# EAGLE design Chassis board (EAGLE 9.6.2)
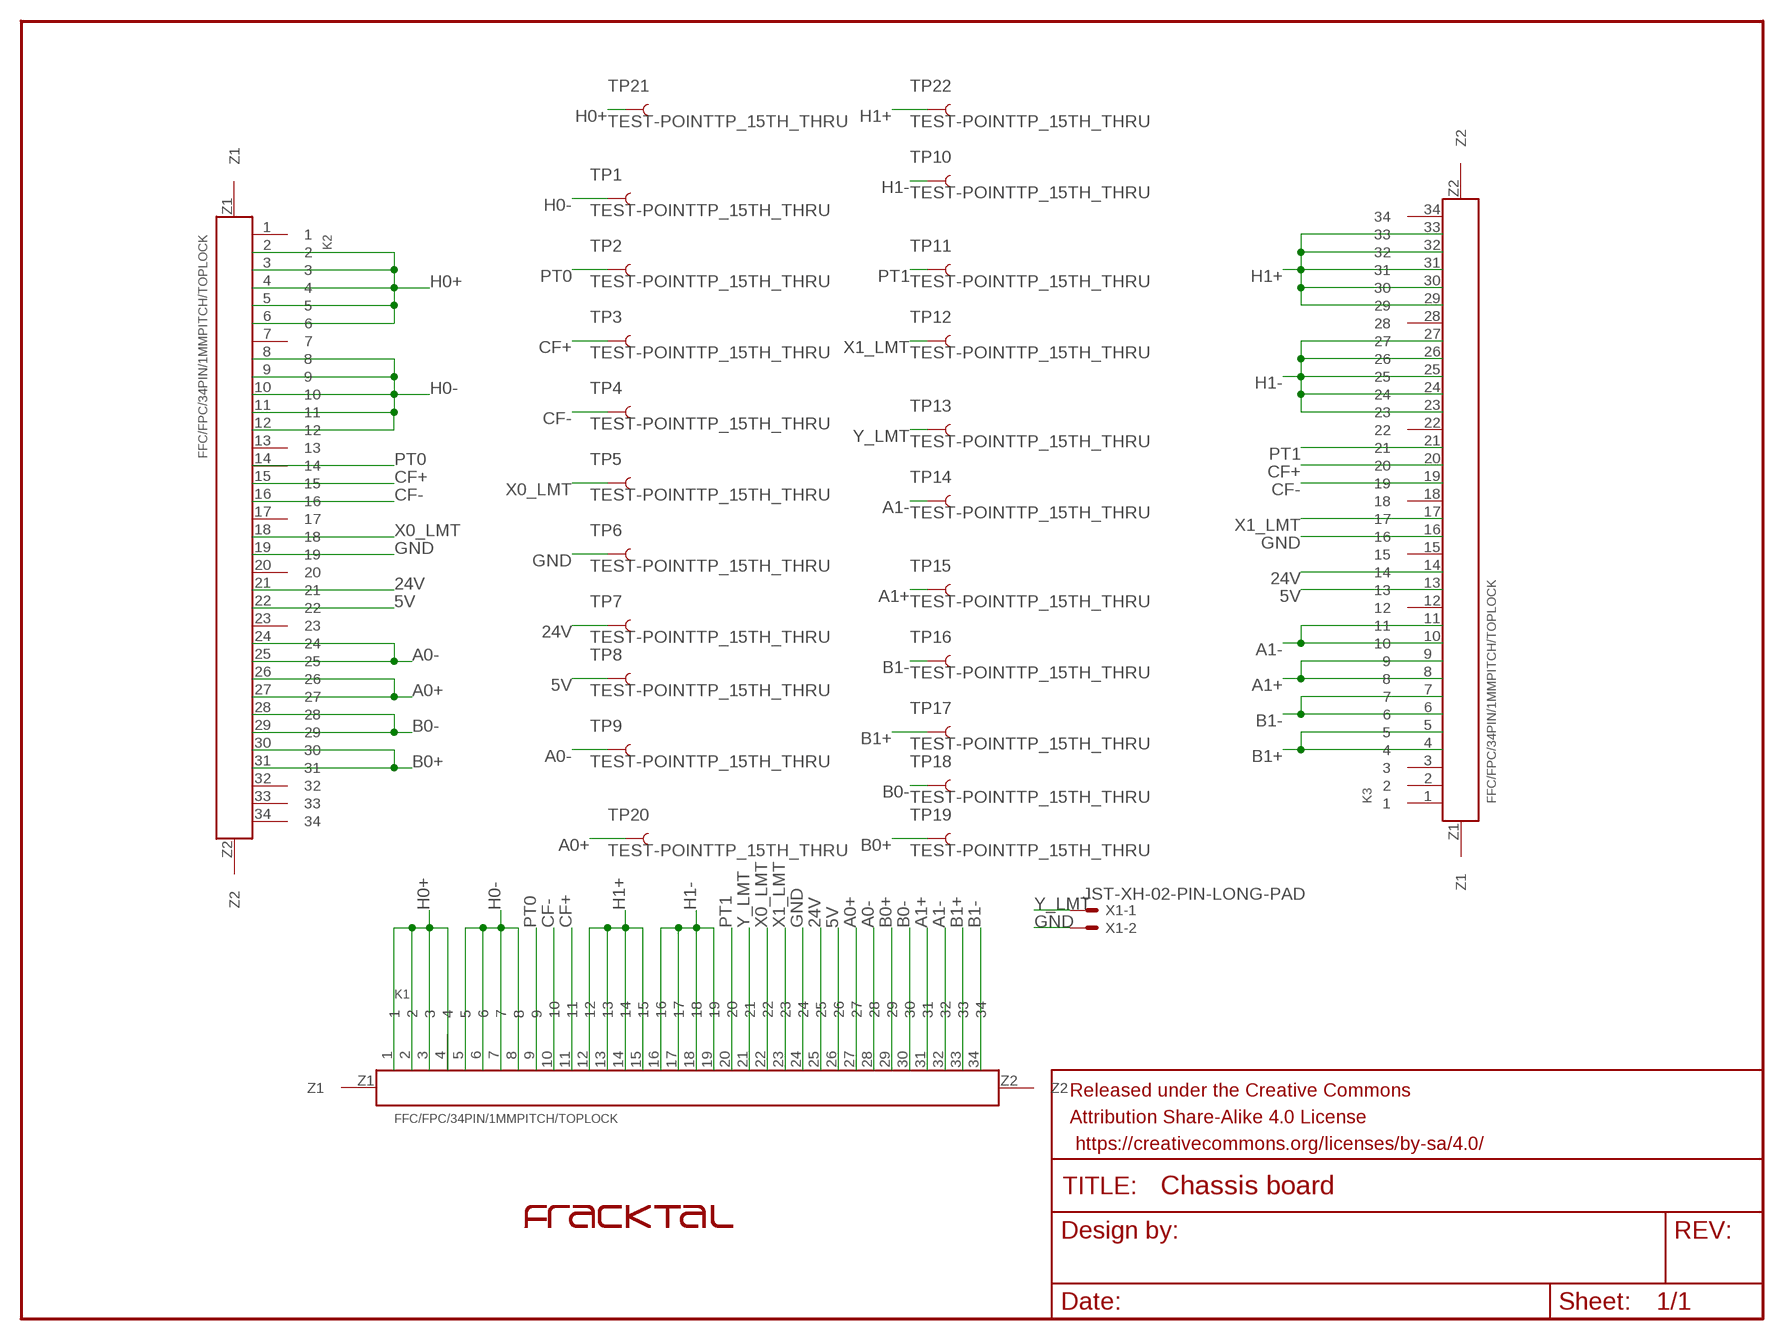
[diagram p0: schematic, sheet 1]

## Parts
FRAME1  FRAME-LETTER  [CREATIVE_COMMONS]
K1  FFC/FPC/34PIN/1MMPITCH/TOPLOCK  [34PIN/1MMPITCH/FFC/FPC]
K2  FFC/FPC/34PIN/1MMPITCH/TOPLOCK  [34PIN/1MMPITCH/FFC/FPC]
K3  FFC/FPC/34PIN/1MMPITCH/TOPLOCK  [34PIN/1MMPITCH/FFC/FPC]
TP1  TEST-POINTTP_15TH_THRU  [TP_15TH]
TP2  TEST-POINTTP_15TH_THRU  [TP_15TH]
TP3  TEST-POINTTP_15TH_THRU  [TP_15TH]
TP4  TEST-POINTTP_15TH_THRU  [TP_15TH]
TP5  TEST-POINTTP_15TH_THRU  [TP_15TH]
TP6  TEST-POINTTP_15TH_THRU  [TP_15TH]
TP7  TEST-POINTTP_15TH_THRU  [TP_15TH]
TP8  TEST-POINTTP_15TH_THRU  [TP_15TH]
TP9  TEST-POINTTP_15TH_THRU  [TP_15TH]
TP10  TEST-POINTTP_15TH_THRU  [TP_15TH]
TP11  TEST-POINTTP_15TH_THRU  [TP_15TH]
TP12  TEST-POINTTP_15TH_THRU  [TP_15TH]
TP13  TEST-POINTTP_15TH_THRU  [TP_15TH]
TP14  TEST-POINTTP_15TH_THRU  [TP_15TH]
TP15  TEST-POINTTP_15TH_THRU  [TP_15TH]
TP16  TEST-POINTTP_15TH_THRU  [TP_15TH]
TP17  TEST-POINTTP_15TH_THRU  [TP_15TH]
TP18  TEST-POINTTP_15TH_THRU  [TP_15TH]
TP19  TEST-POINTTP_15TH_THRU  [TP_15TH]
TP20  TEST-POINTTP_15TH_THRU  [TP_15TH]
TP21  TEST-POINTTP_15TH_THRU  [TP_15TH]
TP22  TEST-POINTTP_15TH_THRU  [TP_15TH]
U$2  FRACKTALLOGO  [FRACKTALLOGO]
X1  JST-XH-02-PIN-LONG-PAD  [JST-XH-02-PACKAGE-LONG-PAD]

## Nets
5V: K1.26 K2.22 K3.13 TP8.P$1
24V: K1.25 K2.21 K3.14 TP7.P$1
A0+: K1.27 K2.26 K2.27 TP20.P$1
A0-: K1.28 K2.24 K2.25 TP9.P$1
A1+: K1.31 K3.8 K3.9 TP15.P$1
A1-: K1.32 K3.10 K3.11 TP14.P$1
B0+: K1.29 K2.30 K2.31 TP19.P$1
B0-: K1.30 K2.28 K2.29 TP18.P$1
B1+: K1.33 K3.4 K3.5 TP17.P$1
B1-: K1.34 K3.6 K3.7 TP16.P$1
CF+: K1.11 K2.15 K3.20 TP3.P$1
CF-: K1.10 K2.16 K3.19 TP4.P$1
GND: K1.24 K2.19 K3.16 TP6.P$1 X1.2
H0+: K1.1 K1.2 K1.3 K1.4 K2.2 K2.3 K2.4 K2.5 K2.6 TP21.P$1
H0-: K1.5 K1.6 K1.7 K1.8 K2.8 K2.9 K2.10 K2.11 K2.12 TP1.P$1
H1+: K1.12 K1.13 K1.14 K1.15 K3.29 K3.30 K3.31 K3.32 K3.33 TP22.P$1
H1-: K1.16 K1.17 K1.18 K1.19 K3.23 K3.24 K3.25 K3.26 K3.27 TP10.P$1
PT0: K1.9 K2.14 TP2.P$1
PT1: K1.20 K3.21 TP11.P$1
X0_LMT: K1.22 K2.18 TP5.P$1
X1_LMT: K1.23 K3.17 TP12.P$1
Y_LMT: K1.21 TP13.P$1 X1.1
Unconnected: K1.Z1 K1.Z2 K2.1 K2.7 K2.13 K2.17 K2.20 K2.23 K2.32 K2.33 K2.34 K2.Z1 K2.Z2 K3.1 K3.2 K3.3 K3.12 K3.15 K3.18 K3.22 K3.28 K3.34 K3.Z1 K3.Z2

## Library data of the parts
FRAME1 = SparkFun-Aesthetics:FRAME-LETTER: Schematic Frame - Letter Standard 8.5x11 US Letter frame
K1-K3 = FracktalWorks_Eagle_Library:FFC/FPC/34PIN/1MMPITCH/TOPLOCK
TP1-TP22 = SparkFun-Connectors:TEST-POINT: SparkFun Test Points Bare copper test points for troubleshooting or In-Circuit-Testing. These are used by our Production team for verifying production board runs using pogo-pins on test beds. SparkFun Products: SparkFun LSM9DS1 Breakout <https://www.sparkfun.com/products/13284> SparkFun PSOC <https://www.sparkfun.com/products/13714> SparkFun Load Cell Amplifier <https://www.sparkfun.com/products/13879>
U$2 = FracktalWorks_Eagle_Library:FRACKTALLOGO
X1 = Rembrandt Electronics - JST XH Connectors v1-0:JST-XH-02-PIN: JST XH Connector 2 Pin Wire to board connector. Pitch: 2,54 mm, (0.100") Number of pins: 2 Created by Rembrandt Electronics www.rembrandtelectronics.com

## Board
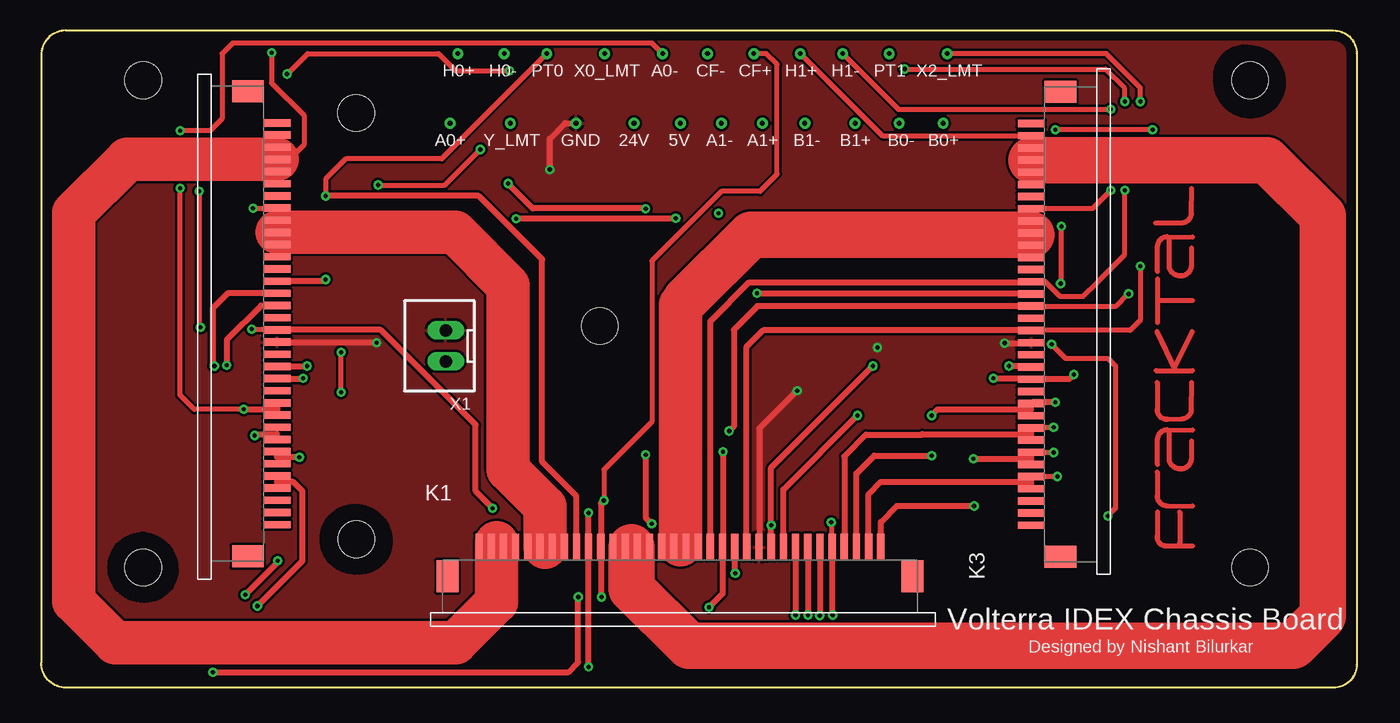
[diagram p1: board, top side]
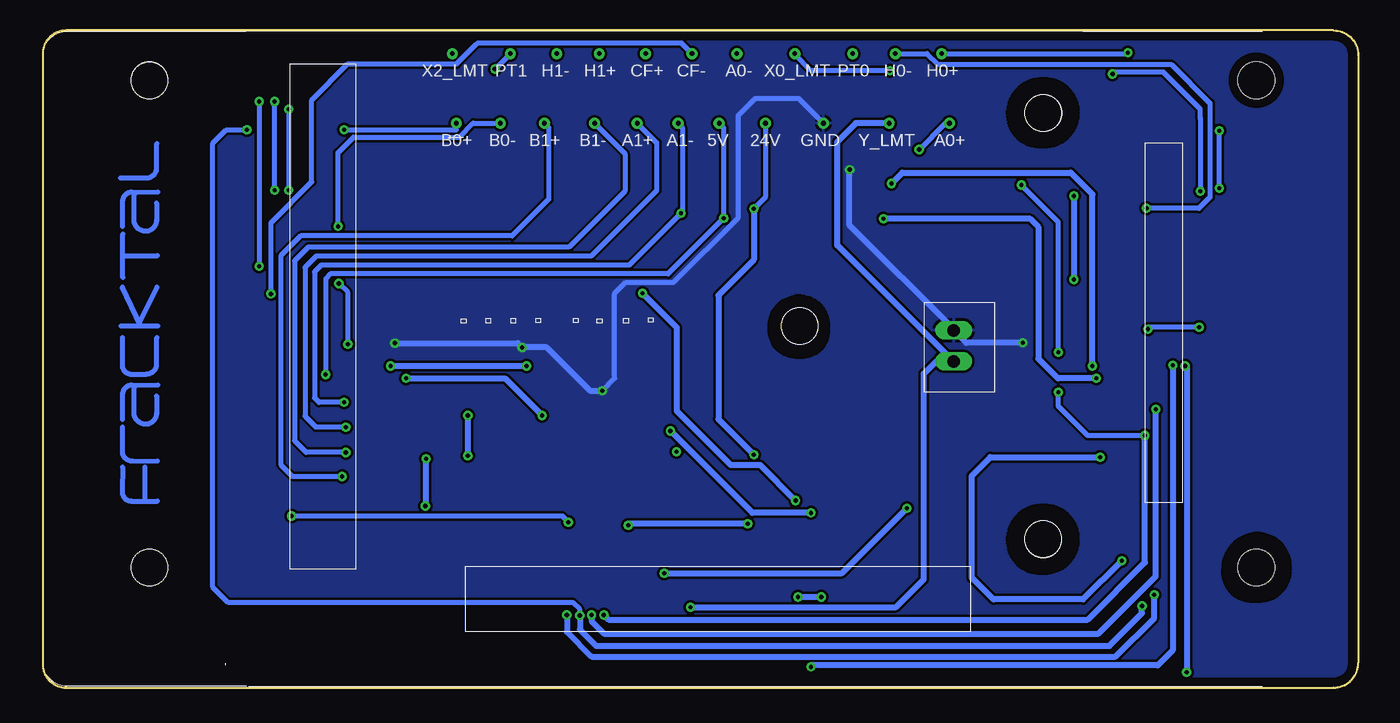
[diagram p2: board, bottom side, seen from below]

Size 108.08 x 53.97 mm. Coordinates in mm from the lower left corner, seen from the top.
Outline: 2.03,53.97 106.17,53.97 arc-90 108.08,52.07 108.08,1.9 arc-90 106.17,0 2.03,0 arc-90 0,2.03 0,51.94 arc-90 2.03,53.97
Copper layers (1*16): Top 0.035mm / dielectric 1.5mm / Bottom 0.035mm
Design rules "LionCircuits": minimum track width 8mil, minimum drill 0.35mm, track to track 8mil, track to pad 8mil, pad to pad 8mil, via to via 8mil, smd to smd 8mil, copper to edge 30mil, drill to drill 10mil, minimum pad ring 10mil, minimum via ring 8mil, stop-mask expansion 4mil, vias tented up to drill 0mil, thermal gap 10mil
Holes 3 mm at 8.38,49.88 99.32,49.88 99.32,9.88 8.38,9.88 25.88,47.18 25.89,12.2 45.88,29.7

### Footprints (pad centres in the part's own frame; a part is rotated, then mirrored left to right if it is on the bottom)
34PIN/1MMPITCH/FFC/FPC = smd 0.6 x 2.2: 1 -14.43,2.1; 2 -13.43,2.1; 3 -12.43,2.1; 4 -11.43,2.1; 5 -10.43,2.1; 6 -9.43,2.1; 7 -8.43,2.1; 8 -7.43,2.1; 9 -6.43,2.1; 10 -5.43,2.1; 11 -4.43,2.1; 12 -3.43,2.1; 13 -2.43,2.1; 14 -1.43,2.1; 15 -0.43,2.1; 16 0.57,2.1; 17 1.57,2.1; 18 2.57,2.1; 19 3.57,2.1; 20 4.57,2.1; 21 5.57,2.1; 22 6.57,2.1; 23 7.57,2.1; 24 8.57,2.1; 25 9.57,2.1; 26 10.57,2.1; 27 11.57,2.1; 28 12.57,2.1; 29 13.57,2.1; 30 14.57,2.1; 31 15.57,2.1; 32 16.57,2.1; 33 17.57,2.1; 34 18.57,2.1 | smd 1.8 x 2.6: Z1 -17.03,-0.3; Z2 21.17,-0.3
TP_15TH = drill 0.381 pad 0.61: P$1 0,0
JST-XH-02-PACKAGE-LONG-PAD = drill 1.016 long: 1 -1.27,0; 2 1.27,0

### Placement (x,y rotation side)
FRAME1  -81.79,43.18 0 top  (outside the outline)
K1  50.4,9.45 0 top
K2  17.27,31.95 270 top
K3  83.43,27.76 90 top
TP1  38.04,52.07 0 bottom
TP2  41.53,52.07 0 bottom
TP3  58.55,52.07 0 bottom
TP4  54.74,52.07 0 bottom
TP5  46.29,52.07 0 bottom
TP6  43.94,46.35 0 bottom
TP7  48.7,46.35 0 bottom
TP8  52.51,46.35 0 bottom
TP9  51.05,52.07 0 bottom
TP10  65.85,52.07 0 bottom
TP11  69.66,52.07 0 bottom
TP12  74.42,52.07 0 bottom
TP13  38.54,46.35 0 bottom
TP14  55.88,46.35 0 bottom
TP15  59.25,46.35 0 bottom
TP16  62.74,46.35 0 bottom
TP17  66.87,46.35 0 bottom
TP18  70.48,46.35 0 bottom
TP19  74.1,46.35 0 bottom
TP20  33.59,46.35 0 bottom
TP21  34.23,52.07 0 bottom
TP22  62.36,52.07 0 bottom
U$2  94.68,23.62 90 top
U$3  FRACKTALLOGO  [FRACKTALLOGO]  98.55,27.3 90 bottom
X1  33.24,28.07 90 top

### Tracks (layer width: path | path; a pad name or v marks a point on that pad's centre or on a via)
5V  (via drill 0.35)
  Top 0.508: K1.26 60.97,16.27 v67.06,22.35 | v78.23,25.4 81.26,25.4 K3.13 84.45,25.33 v84.84,25.72 | K2.22 21.5,25.38 v21.52,25.4 | v52.13,38.54 52.09,38.5 v39.01,38.5
  Bottom 0.406: v84.84,25.72 84.84,33.59 84.45,33.97 56.7,33.97 v52.13,38.54 52.13,45.97 TP8.P$1
  Bottom 0.508: v78.23,25.4 70.1,25.4 v67.06,22.35 | v21.52,25.4 24.67,25.4 26.29,27.02 26.29,37.85 26.94,38.5 v39.01,38.5
24V  (via drill 0.35)
  Top 0.508: K1.25 v59.97,13.33 59.97,18.06 v68.33,26.42 | v79.5,26.42 81.24,26.42 K3.14 | K2.21 21.81,26.38 v21.84,26.42 | v38.35,41.4 40.39,39.37 49.62,39.37 v49.66,39.34 | v49.66,19.12 49.66,13.96 v50.16,13.46
  Bottom 0.406: TP7.P$1 48.7,40.29 v49.66,39.34
  Bottom 0.508: v79.5,26.42 v68.33,26.42 | v21.84,26.42 21.84,40.51 23.62,42.29 37.47,42.29 v38.35,41.4 | v49.66,39.34 49.66,35.14 52.58,32.22 52.58,22.04 v49.66,19.12 | v50.16,13.46 59.84,13.46 v59.97,13.33
A0+  (via drill 0.35)
  Top 0.203: K2.26 19.37,20.83 K2.27
  Top 0.406: v24.64,24.26 v24.64,27.55 | v27.69,41.27 33.15,41.27 v36.07,44.2
  Top 0.508: K1.27 v61.97,5.97 v61.98,5.97 | v17.53,20.7 17.65,20.83 19.37,20.83
  Bottom 0.406: v17.53,20.7 22.23,20.7 24.64,23.11 v24.64,24.26 | v24.64,27.55 24.64,38.23 v27.69,41.27 | v36.07,44.2 33.91,46.35 TP20.P$1
  Bottom 0.508: v61.98,5.97 61.59,5.59 22.23,5.59 17.53,10.29 v17.53,20.7
A0-  (via drill 0.35)
  Top 0.406: v16.64,22.86 12.57,22.86 11.41,24.03 v11.41,41.02 | TP9.P$1 50.19,52.93 15.72,52.93 14.86,52.07 14.86,46.74 13.87,45.74 v11.41,45.74
  Top 0.508: K2.24 19.37,22.86 | 19.37,22.86 K2.25 | K1.28 62.97,5.99 v62.99,5.97 | v16.64,22.86 19.37,22.86
  Bottom 0.406: v11.41,41.02 v11.41,45.74
  Bottom 0.508: v62.99,5.97 62.99,5.46 61.98,4.45 21.34,4.45 16.64,9.14 v16.64,22.86
A1+  (via drill 0.35)
  Top 0.406: K3.8 81.33,20.83 K3.9 83.12,21.33 v83.17,21.39 | 72.34,20.78 72.39,20.83
  Top 0.508: K1.31 65.97,18.98 67.77,20.78 72.34,20.78 | 72.39,20.83 81.33,20.83
  Bottom 0.406: v83.17,21.39 85.63,21.39 86.53,22.29 86.53,34.51 85.6,35.45 63.02,35.45 57.65,40.82 57.65,44.75 TP15.P$1
A1-  (via drill 0.35)
  Top 0.203: 81.33,23.22 81.33,22.86 K3.10
  Top 0.406: K3.11 81.33,23.22
  Top 0.508: K1.32 66.97,17.57 68.45,19.05 v73.15,19.05 | v83.31,23.43 81.43,23.43 K3.11 | v73.15,22.35 73.66,22.86 81.33,22.86
  Bottom 0.406: v83.31,23.43 85.39,23.43 85.75,23.79 85.75,34.16 85.19,34.71 59.91,34.71 v55.65,38.96 55.52,39.09 55.52,46 TP14.P$1
  Bottom 0.508: v73.15,19.05 v73.15,22.35
B0+  (via drill 0.35)
  Top 0.203: K2.30 19.37,16.89 K2.31
  Top 0.406: v91.31,45.82 v83.31,45.82
  Top 0.508: K1.29 63.97,5.94 v63.95,5.91 | 19.37,16.89 20.7,16.89 21.46,16.13 21.46,10.41 v17.76,6.71
  Bottom 0.406: v63.95,5.91 63.95,6.42 64.52,6.98 92.84,6.98 94.11,8.25 94.11,44.7 92.99,45.82 v91.31,45.82 | v83.31,45.82 74.1,45.82 TP19.P$1
  Bottom 0.508: v63.95,5.91 63.95,4.77 62.61,3.43 20.45,3.43 17.76,6.12 v17.76,6.71
B0-  (via drill 0.35)
  Top 0.203: K2.28 19.37,18.92 K2.29
  Top 0.406: K1.30 64.97,13.51 v64.9,13.59 | v83.75,33.19 83.81,33.26 v83.81,37.88 | v87.63,14.1 88.27,14.73 88.27,26.42 87.63,27.05 84.15,27.05 v83.01,28.19
  Top 0.508: K1.30 64.97,6.02 v65.02,5.97 | v19.43,10.41 19.43,10.29 v16.76,7.62 | v21.21,18.92 19.37,18.92
  Bottom 0.406: v87.63,14.1 65.41,14.1 v64.9,13.59 | v83.01,28.19 83.01,32.45 v83.75,33.19 | v83.81,37.88 83.81,43.95 82.55,45.21 73.85,45.21 72.71,46.35 TP18.P$1
  Bottom 0.508: v65.02,5.97 65.02,4.57 62.99,2.54 19.94,2.54 16.76,5.71 v16.76,7.62 | v19.43,10.41 22.61,7.24 29.97,7.24 31.75,9.02 31.75,17.4 30.23,18.92 v21.21,18.92
B1+  (via drill 0.35)
  Top 0.406: v83.48,17.34 K3.5 K3.4
  Top 0.508: K1.33 67.97,15.9 68.96,16.89 81.33,16.89 K3.4
  Bottom 0.406: v83.48,17.34 87.54,17.34 88.52,18.31 88.52,35.46 86.88,37.1 69.51,37.1 66.51,40.09 66.51,46 TP17.P$1
B1-  (via drill 0.35)
  Top 0.406: 81.33,18.8 K3.6 K3.7 81.34,19.32 v83.17,19.32
  Top 0.508: K1.34 68.97,13.6 70.29,14.92 v76.64,14.92 | v76.58,18.8 81.33,18.8
  Bottom 0.406: v83.17,19.32 86.43,19.32 87.4,20.28 87.4,35.05 86.27,36.18 64.85,36.18 60.25,40.78 60.25,43.87 TP16.P$1
  Bottom 0.508: v76.64,14.92 76.64,18.73 v76.58,18.8
CF+  (via drill 0.35)
  Top 0.406: v46.23,15.37 46.23,17.91 50.16,21.84 50.16,35.05 55.88,40.77 59.05,40.77 60.45,42.16 60.45,51.18 59.56,52.07 TP3.P$1
  Top 0.508: K3.20 58.85,32.33 v58.8,32.38 | v46.23,15.37 45.97,15.11 K1.11 46.03,11.49 v46.03,7.44 | K2.15 15.31,32.38 14.1,31.17 14.1,26.54 v14.22,26.42 | v14.1,1.27 43.31,1.27 44.12,2.09 v44.12,7.44
  Bottom 0.508: v58.8,32.38 56.01,29.59 56.01,22.73 51.56,18.29 49.15,18.29 v46.23,15.37 | v14.22,26.42 14.1,26.29 v14.1,1.27 | v44.12,7.44 v46.03,7.44
CF-  (via drill 0.35)
  Top 0.406: K3.19 88.32,31.33 v89.33,32.34
  Top 0.508: v44.96,14.35 44.97,14.34 K1.10 44.96,11.54 v44.96,1.7 | v56.52,21.08 56.9,21.46 56.9,29.39 58.84,31.33 K3.19 | K2.16 18.05,31.38 15.24,28.57 v15.24,26.49
  Bottom 0.406: v89.33,32.34 89.33,38.18 85.98,41.53 85.98,48.26 83.02,51.22 74.07,51.22 72.42,52.86 72.35,52.93 55.6,52.93 TP4.P$1
  Bottom 0.508: v44.96,14.35 49.78,14.35 v56.52,21.08 | v15.24,26.49 15.24,3.06 16.47,1.83 44.83,1.83 v44.96,1.7
GND  (via drill 0.35)
  Top 0.508: K1.24 59,11.58 59,21.29 v62.1,24.38 | v79.15,28.3 81.29,28.3 K3.16 | K2.19 27.5,28.38 v27.56,28.32 | v41.78,42.54 41.78,45.09 43.05,46.35 TP6.P$1
  Bottom 0.406: v62.1,24.38 61.09,25.4 61.09,32.38 60.2,33.27 56.26,33.27 50.93,38.61 50.93,46.99 49.53,48.39 45.97,48.39 TP6.P$1
  Bottom 0.508: v62.1,24.38 63.12,24.38 66.67,27.94 v68.71,27.94 69.06,28.3 v79.15,28.3 | v27.56,28.32 32.22,28.32 X1.2 33.24,29.43 41.78,37.97 v41.78,42.54
  pour Top: 107.06,54.23 0.89,54.23 -0.51,52.83 -0.51,1.21 1.02,-0.32 106.93,-0.32 108.39,1.14 108.39,52.9
  pour Bottom: 106.87,54.04 1.27,54.04 -0.25,52.51 -0.25,1.33 1.21,-0.13 106.87,-0.13 108.2,1.21 108.2,52.7
  cutout Top: 99.35,12.86 arc90 96.33,9.84 arc90 99.35,6.83 arc90 102.36,9.84 arc90
  cutout Top: 98.87,52.7 arc90 96.33,50.16 96.33,49.85 arc90 99.35,46.83 arc90 102.2,49.69 arc90 99.19,52.7 98.55,52.7
  cutout Bottom: 99.19,13.02 arc90 96.17,10 arc90 99.19,6.98 99.82,6.98 arc90 102.36,9.53 102.36,9.84 arc90 99.19,13.02 98.87,13.02
  cutout Bottom: 98.87,52.7 arc90 96.33,50.16 96.33,49.85 arc90 99.35,46.83 arc90 102.2,49.69 arc90 99.19,52.7
  cutout Top: 25.96,50.06 arc-90 28.8,47.22 28.8,47.04 arc-90 26.14,44.37 25.78,44.37 arc-90 22.94,47.22 arc-90 25.78,50.06
  cutout Top: 25.78,15.04 arc-90 28.8,12.01 arc-90 26.14,9.35 25.78,9.35 arc-90 22.94,12.19 arc-90
  cutout Top: 8.18,12.73 arc-90 11.2,9.7 arc-90 8.53,7.04 8.36,7.04 arc-90 5.51,9.88 arc-90 8.36,12.73 8.53,12.73
  cutout Bottom: 25.96,15.04 arc-90 28.89,12.1 arc-90 26.14,9.35 25.78,9.35 arc-90 22.94,12.19 arc-90 25.78,15.04
  cutout Bottom: 25.96,50.06 arc-90 28.89,47.13 arc-90 26.14,44.37 25.78,44.37 arc-90 22.94,47.22 arc-90 25.78,50.06
  cutout Bottom: 8.18,12.73 arc-90 11.2,9.7 11.2,9.53 arc-90 8.71,7.04 8.18,7.04 arc-90 5.51,9.7 5.51,9.88 arc-90 8.36,12.73 8.53,12.73
  cutout Top: 8.18,52.73 arc-90 11.11,49.8 arc-90 8.45,47.13 arc-90 5.51,50.06 arc-90
  cutout Top: 45.91,32.19 arc-90 48.51,29.59 arc-90 45.97,27.05 arc-90 43.37,29.65 arc-90
  cutout Bottom: 45.85,32.26 arc-90 48.51,29.59 48.51,29.46 arc-90 46.1,27.05 45.72,27.05 arc-90 43.43,29.34 43.43,29.72 arc-90 45.97,32.26 46.23,32.26
H0+  (via drill 0.35)
  Top 0.203: K1.4 K1.3 K1.2 K1.1 36.33,11.9 37.41,11.9 | K2.2 K2.3 K2.4 K2.5 K2.6
  Top 0.406: v18.92,52.15 18.92,49.66 21.59,46.99 21.59,44.58 20.4,43.38 K2.4 | 6.92,43.24 7.06,43.38
  Top 3.556: 37.41,11.9 37.41,7.06 34.04,3.68 6.1,3.68 2.67,7.11 2.67,38.99 6.92,43.24 | 7.06,43.38 K2.4
  Bottom 0.406: TP21.P$1 19,52.07 v18.92,52.15
H0-  (via drill 0.35)
  Top 0.203: K1.5 K1.6 41.4,11.55 K1.7 K1.8 | K2.8 K2.9 K2.10 K2.11 K2.12
  Top 0.406: v17.4,39.37 17.41,39.38 K2.8
  Top 3.556: K2.10 33.99,37.38 38.35,33.02 38.35,17.91 41.4,14.86 41.4,11.55
  Bottom 0.406: TP1.P$1 35.43,52.07 34.54,51.18 15.37,51.18 12.19,48.01 12.19,40.26 13.08,39.37 v17.4,39.37
H1+
  Top 0.203: K1.12 K1.13 48.51,11.55 K1.14 K1.15 | K3.30 K3.29
  Top 0.406: K3.33 69.09,45.33 TP22.P$1
  Top 0.508: K3.32 K3.33
  Top 1.27: K3.32 K3.31 K3.30
  Top 3.81: K3.31 100.69,43.33 105.28,38.73 105.28,5.84 102.87,3.43 53.21,3.43 48.51,8.13 48.51,11.55
H1-  (via drill 0.35)
  Top 0.203: K1.16 K1.17 K1.18 | K1.19 K1.18 | 52.51,11.73 52.69,11.55 K1.18 | K3.27 K3.26 K3.25 81.33,37.21 K3.24 K3.23
  Top 0.406: TP10.P$1 70.42,47.5 v87.88,47.5 | v87.88,40.85 86.37,39.33 K3.27
  Top 3.556: 52.97,31.89 52.51,31.43 52.51,11.73
  Top 3.81: 52.97,31.89 58.29,37.21 81.33,37.21
  Bottom 0.406: v87.88,47.5 v87.88,40.85
PT0  (via drill 0.35)
  Top 0.406: TP2.P$1 32.89,43.43 25.02,43.43 23.37,41.78 v23.37,40.39
  Top 0.508: K1.9 43.97,15.72 41.15,18.54 41.15,35.18 35.94,40.39 v23.37,40.39 | v23.37,33.53 23.22,33.38 K2.14
  Bottom 0.508: v23.37,40.39 v23.37,33.53
PT1  (via drill 0.35)
  Top 0.406: v70.93,50.8 87.44,50.8 89.03,49.21 v89.03,48.13 | v89.03,40.85 89.03,35.56 86.8,33.33 85.6,32.13 83.69,32.13 82.49,33.33
  Top 0.508: K1.20 54.97,30.08 58.17,33.27 81.27,33.27 K3.21 82.49,33.33
  Bottom 0.406: TP11.P$1 v70.93,50.8 | v89.03,40.85 v89.03,48.13
X0_LMT  (via drill 0.35)
  Top 0.406: v12.98,40.77 12.98,29.7 v13.08,29.59 | v17.29,29.45 19.31,29.45 K2.18 | v20.19,50.4 21.87,52.07 32.64,52.07 34.04,50.67 v38.48,50.67
  Top 0.508: K1.22 56.97,9.45 v57.02,9.4 | v37.08,14.73 35.69,16.13 35.69,21.59 27.89,29.38 K2.18
  Bottom 0.406: v12.98,40.77 12.98,46.74 12.98,46.78 12.98,47.52 16,50.55 20.04,50.55 v20.19,50.4 | v13.08,29.59 17.14,29.59 v17.29,29.45 | v38.48,50.67 44.96,50.67 46.29,52.01 TP5.P$1
  Bottom 0.508: v57.02,9.4 42.42,9.4 v37.08,14.73
X1_LMT  (via drill 0.35)
  Top 0.406: K3.17 89.47,29.33 90.3,30.16 v90.3,34.61 | TP12.P$1 87.5,52.07 90.3,49.28 v90.3,48.13
  Top 0.508: K1.23 57.91,11.61 57.91,27.94 59.3,29.33 K3.17
  Bottom 0.406: v90.3,48.13 v90.3,34.61
Y_LMT  (via drill 0.35)
  Top 0.406: K1.21 55.97,11.11
  Top 0.508: v56.01,19.37 56.01,11.15 55.97,11.11 | K1.21 55.97,7.71 v54.86,6.6
  Bottom 0.508: v54.86,6.6 37.97,6.6 35.69,8.89 35.69,25.78 34.67,26.8 33.27,26.8 | 33.27,26.8 X1.1 | 33.27,26.8 42.8,36.32 42.8,44.83 41.27,46.35 TP13.P$1

### Text on the board
tPlace: H0+ | H0- | PT0 | X0_LMT | A0- | CF- | CF+ | H1+ | H1- | PT1 | X2_LMT | A0+ | Y_LMT | GND | 24V | 5V | A1- | A1+ | B1- | B1+ | B0- | B0+ | Volterra IDEX Chassis Board | Designed by Nishant Bilurkar
bPlace: H0+ | H0- | PT0 | X0_LMT | A0- | CF- | CF+ | H1+ | H1- | PT1 | X2_LMT | A0+ | Y_LMT | GND | 24V | 5V | A1- | A1+ | B1- | B1+ | B0- | B0+